# EAGLE design firefly099 (EAGLE 6.4)
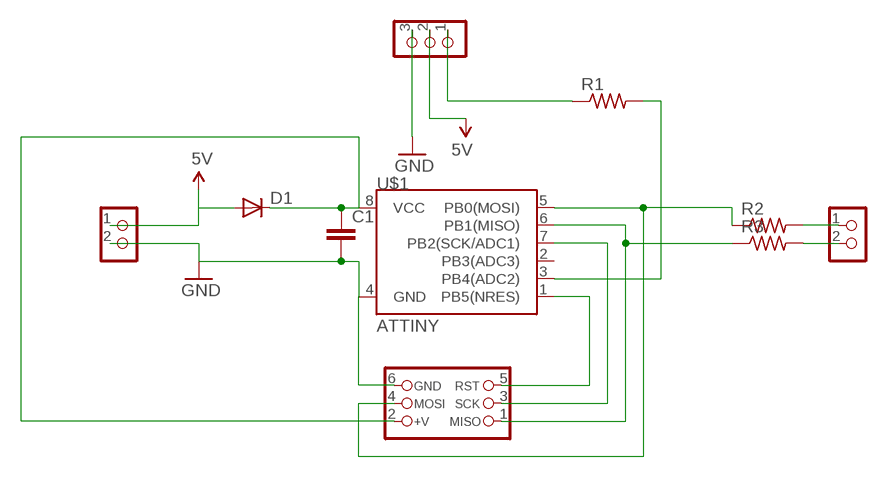
[diagram p0: schematic, sheet 1]

## Parts
-,+  CON_TERMINAL_BLOCK_02-5MM  [TERMINAL_BLOCK_2P_5]
C1  CAPPTH  [CAP-PTH-SMALL]
D1  1N4004  [DO41-10]
IO  CON_TERMINAL_BLOCK_02-5MM  [TERMINAL_BLOCK_2P_5]
J3  CON_HEADER_PRG_AVR_ICSP-PTH  [HEADER_PRG_2X03]
LED  CON_TERMINAL_BLOCK_03-5MM  [TERMINAL_BLOCK_3P_5]
R1  R-US_0207/2V  [0207/2V]
R2  R-US_0207/2V  [0207/2V]
R3  R-US_0207/2V  [0207/2V]
U$1  ATTINY  ATTINY45DIP8  [DIP08]

## Nets
5V: -,+.1 D1.A LED.2
GND: -,+.2 C1.2 J3.6(GND) LED.3 U$1.4(GND)
N$1: C1.1 D1.C J3.2(+V) U$1.8(VCC)
N$2: J3.5(RST) U$1.1(PB5(NRES))
N$3: J3.3(SCK) U$1.7(PB2(SCK/ADC1))
N$4: J3.1(MISO) R3.1 U$1.6(PB1(MISO))
N$5: J3.4(MOSI) R2.1 U$1.5(PB0(MOSI))
N$6: R1.2 U$1.3(PB4(ADC2))
N$7: IO.1 R2.2
N$8: LED.1 R1.1
N$10: IO.2 R3.2
Unconnected: U$1.2(PB3(ADC3))

## Library data of the parts
-,+ IO = dp_devices:CON_TERMINAL_BLOCK_02: 2 poles wire to board terminal block
C1 = SparkFun:CAP: Capacitor Standard 0603 ceramic capacitor, and 0.1" leaded capacitor.
D1 = adafruit:1N4004: DIODE General purpose 1N400x type rectifier (With bigger pads) http://www.ladyada.net/library/pcb/eaglelibrary.html
J3 = dp_devices:CON_HEADER_PRG_AVR_ICSP: 2x3 AVR ICSP programming header
LED = dp_devices:CON_TERMINAL_BLOCK_03: 3 poles, wire to board connector
R1-R3 = rcl:R-US_: RESISTOR, American symbol
U$1 = SparkFun:ATTINY45: Atmel ATTiny45

## Board
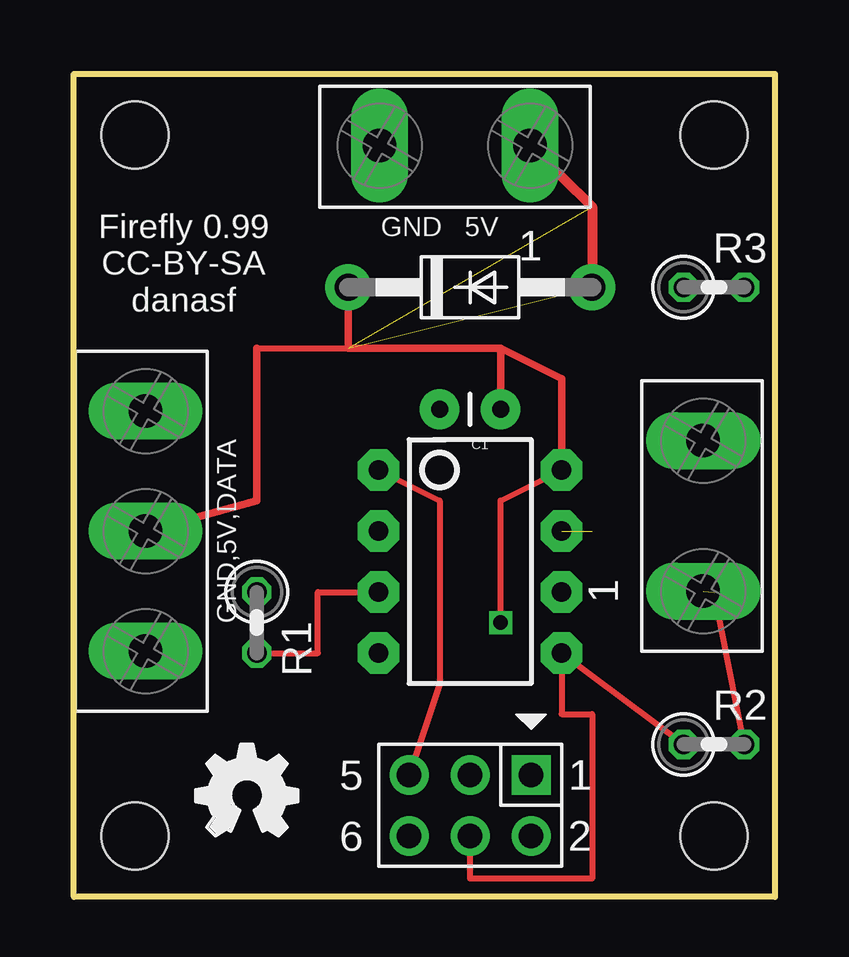
[diagram p1: board, top side]
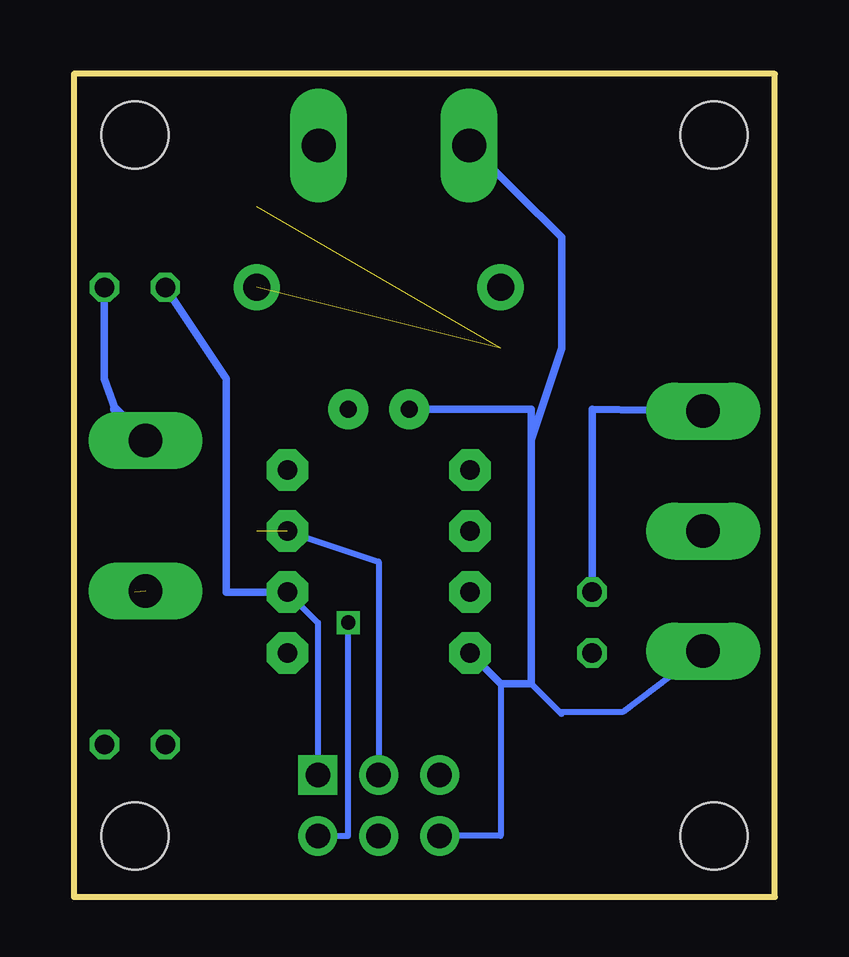
[diagram p2: board, bottom side, seen from below]

Size 29.21 x 34.29 mm. Coordinates in mm from the lower left corner, seen from the top.
Outline: 29.21,34.29 29.21,0 0,0 0,34.29 29.21,34.29
Copper layers (1*16): Top 0.0356mm / dielectric 1.5011mm / Bottom 0.0356mm
Design rules "laen": minimum track width 6mil, minimum drill 13mil, track to track 6mil, track to pad 6mil, pad to pad 6mil, via to via 6mil, smd to smd 6mil, copper to edge 15mil, drill to drill 6mil, minimum pad ring 7mil, minimum via ring 7mil, stop-mask expansion 4mil, vias tented up to drill 0mil, thermal gap 10mil
Holes 2.8 mm at 2.54,31.75 26.67,31.75 2.54,2.54 26.67,2.54

### Footprints (pad centres in the part's own frame; a part is rotated, then mirrored left to right if it is on the bottom)
TERMINAL_BLOCK_2P_5 = drill 1.4 pad 2.38 long: 1 2.5,-0.45; 2 -3.77,-0.45
CAP-PTH-SMALL = drill 0.7 pad 1.651: 1 0,0; 2 2.54,0
DO41-10 = drill 1.118 pad 1.93: A 5.08,0; C -5.08,0
HEADER_PRG_2X03 = drill 1.02 pad 1.632 square: 1 -2.54,-1.27 | drill 1.02 pad 1.632: 2 -2.54,1.27; 3 0,-1.27; 4 0,1.27; 5 2.54,-1.27; 6 2.54,1.27
TERMINAL_BLOCK_3P_5 = drill 1.4 pad 2.38 long: 1 5,-0.45; 2 0,-0.45; 3 -5,-0.45
0207/2V = drill 0.813 octagon: 1 -1.27,0; 2 1.27,0
DIP08 = drill 0.813 pad 1.727 octagon: 1 -3.81,-3.81; 2 -1.27,-3.81; 3 1.27,-3.81; 4 3.81,-3.81; 5 3.81,3.81; 6 1.27,3.81; 7 -1.27,3.81; 8 -3.81,3.81

### Placement (x,y rotation side)
-,+  16.51,31.75 0 top
C1  17.78,20.32 180 top
D1  16.51,25.4 0 top
IO  26.67,15.24 270 top
J3  16.51,3.81 180 top
LED  2.54,15.24 90 top
R1  7.62,11.43 270 top
R2  26.67,6.35 0 top
R3  26.67,25.4 0 top
U$1  16.51,13.97 270 top
U$4  [OSHW_FILLX150_NOTEXT]  5.08,2.54 0 top

### Tracks (layer width: path | path; a pad name or v marks a point on that pad's centre or on a via)
5V  (2 unrouted)
  Top 0.254: 7.62,22.86 11.43,22.86
  Top 0.305: LED.2 7.62,16.51 7.62,22.86
  Top 0.406: -,+.1 21.59,28.76 D1.A
GND
  Bottom 0.254: J3.6 11.43,2.54 11.43,8.89 | LED.3 6.35,7.7 8.89,7.7 8.89,7.62 10.16,8.89
  Bottom 0.305: -,+.2 8.89,27.49 8.89,22.86 10.16,19.05 | 10.16,19.05 10.16,20.32 C1.2 | U$1.4 11.43,8.89 10.16,8.89 10.16,19.05
N$1  (via drill 0.6)
  Top 0.254: v17.78,11.43 17.78,16.51 U$1.8
  Top 0.305: D1.C 11.43,22.86 17.78,22.86 | 17.78,22.86 C1.1 | U$1.8 20.32,21.59 17.78,22.86
  Bottom 0.254: J3.2 17.78,2.54 v17.78,11.43
N$2
  Top 0.254: J3.5 15.24,8.89 15.24,16.51 U$1.1
N$3  (1 unrouted)
  Bottom 0.254: J3.3 16.51,13.97 U$1.7
N$4
  Bottom 0.254: J3.1 19.05,11.43 U$1.6
  Bottom 0.305: U$1.6 22.86,12.7 22.86,21.59 R3.1
N$5
  Top 0.254: J3.4 16.51,0.76 21.59,0.76 21.59,7.62 20.32,7.62 U$1.5 R2.1
N$6
  Top 0.254: R1.2 10.16,10.16 10.16,12.7 U$1.3
N$7  (1 unrouted)
  Top 0.254: R2.2 26.67,12.7
N$8
  Bottom 0.305: R1.1 7.62,20.32 LED.1
N$10
  Bottom 0.305: R3.2 27.94,21.59 27.49,20.32
  Bottom 0.406: 27.49,20.32 IO.2

### Text on the board
_tsilk: GND 5V | Firefly 0.99 / CC-BY-SA / danasf | GND,5V,DATA